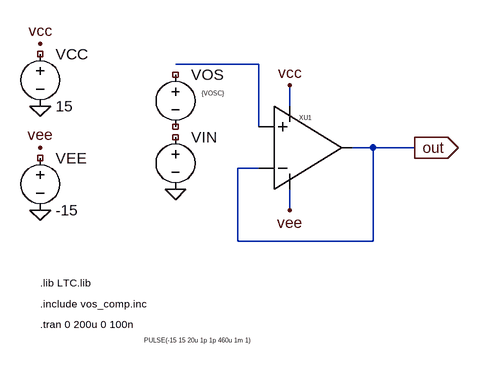
[diagram p0: schematic item6_slew.asc]
item6_slew.asc, the LTspice schematic file:
Version 4
SHEET 1 880 592
WIRE 352 96 480 96
WIRE 480 96 480 192
WIRE 480 256 448 256
WIRE 448 256 448 368
WIRE 448 368 656 368
WIRE 656 368 656 224
WIRE 624 224 656 224
WIRE 656 224 720 224
WIRE 528 160 528 128
WIRE 528 288 528 320
SYMBOL voltage 352 96 R0
WINDOW 3 40 44 Left 0
SYMATTR InstName VOS
SYMATTR Value {VOSC}
SYMBOL voltage 352 192 R0
WINDOW 3 -48 328 Left 0
SYMATTR InstName VIN
SYMATTR Value PULSE(-15 15 20u 1p 1p 460u 1m 1)
SYMBOL voltage 144 64 R0
SYMATTR InstName VCC
SYMATTR Value 15
SYMBOL voltage 144 224 R0
SYMATTR InstName VEE
SYMATTR Value -15
SYMBOL opamp2 480 160 R0
SYMATTR InstName XU1
SYMATTR Value OP07
FLAG 352 288 0
FLAG 144 64 vcc
FLAG 144 160 0
FLAG 144 224 vee
FLAG 144 320 0
FLAG 528 128 vcc
FLAG 528 320 vee
FLAG 720 224 out
IOPIN 720 224 Out
TEXT 144 432 Left 1 !.lib LTC.lib
TEXT 144 464 Left 1 !.include vos_comp.inc
TEXT 144 496 Left 1 !.tran 0 200u 0 100n

The netlist it stands for:
* item6_slew.asc
VOS NC_01 NC_02 {VOSC}
VIN NC_03 0 PULSE(-15 15 20u 1p 1p 460u 1m 1)
VCC NC_04 0 15
VEE NC_05 0 -15
XXU1 CLAW_IDEAL_OPAMP OP07
.lib LTC.lib
.include vos_comp.inc
.tran 0 200u 0 100n
.backanno
.end